# EAGLE design switching_unit (EAGLE 7.2.0)
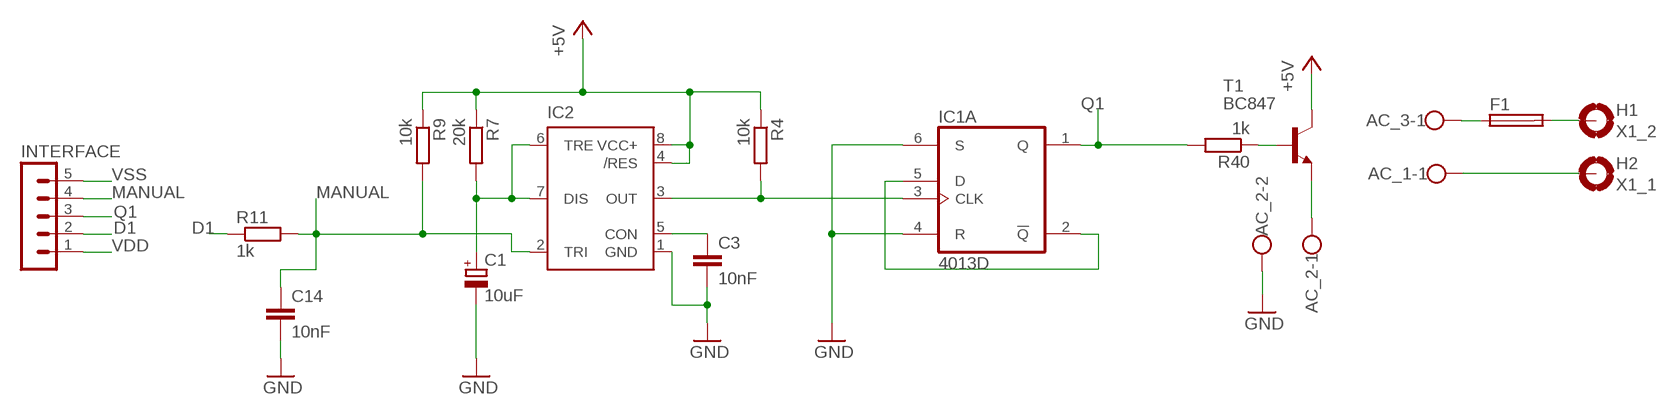
[diagram p0: schematic, sheet 1]

## Parts
AC_1  W237-102  [W237-102]
AC_2  W237-102  [W237-102]
AC_3  W237-102  [W237-102]
C1  10uF  CPOL-EU153CLV-0405  [153CLV-0405]
C3  10nF  C-EUC1206  [C1206]
C14  10nF  C-EUC1206  [C1206]
F1  SH22,5A  [SH22,5A]
H1  X1_2  MOUNT-PAD-ROUND2.8  [2,8-PAD]
H2  X1_1  MOUNT-PAD-ROUND2.8  [2,8-PAD]
IC1  4013D  [SO14]
IC2  NE555D  [SO08]
INTERFACE  MA05-1  [MA05-1]
R4  10k  R-EU_R1206  [R1206]
R7  20k  R-EU_R1206  [R1206]
R9  10k  R-EU_R1206  [R1206]
R11  1k  R-EU_R1206  [R1206]
R40  1k  R-EU_R1206  [R1206]
T1  BC847  [SOT23]

## Nets
D1: INTERFACE.2 R11.1
MANUAL: C14.1 IC2.2(TRI) INTERFACE.4 R9.2 R11.2
N$1: R40.1 T1.1(B)
N$2: F1.2 H1.B2,8(MOUNT)
N$3: AC_1.1 H2.B2,8(MOUNT)
N$4: AC_2.1 T1.2(E)
N$8: IC1.2(A:!Q) IC1.5(A:D)
N$14: IC1.3(A:CLK) IC2.3(OUT) R4.2
N$15: C1.+ IC2.6(TRE) IC2.7(DIS) R7.2
N$18: C3.1 IC2.5(CON)
N$52: AC_3.1 F1.1
Q1: IC1.1(A:Q) INTERFACE.3 R40.2
VDD: IC2.4(/RES) IC2.8(VCC+) INTERFACE.1 R4.1 R7.1 R9.1 T1.3(C) ; supply symbol labelled +5V
VSS: AC_2.2 C1.- C3.2 C14.2 IC1.4(A:R) IC1.6(A:S) IC2.1(GND) INTERFACE.5 ; supply symbol labelled GND
Unconnected: AC_1.2 AC_3.2 IC1.8(B:S) IC1.9(B:D) IC1.10(B:R) IC1.11(B:CLK) IC1.12(B:!Q) IC1.13(B:Q)

## Power pins joined to a net without a drawn wire
VDD: IC1.14(P:VDD)
VSS: IC1.7(P:VSS)

## Library data of the parts
AC_1-AC_3 = con-wago-500:W237-102: WAGO SCREW CLAMP; MPN: 237-102; OC_FARNELL: unknown; OC_NEWARK: 70K9898
C1 = resistor:CPOL-EU: POLARIZED CAPACITOR, European symbol
C3 C14 = rcl:C-EU: CAPACITOR, European symbol
F1 = fuse (2):SH22,5A: FUSE HOLDER grid 22,5mm, isolated cap OGN0031 8201, Schurter (Buerklin)
H1 H2 = holes:MOUNT-PAD-ROUND: MOUNTING PAD, round
IC1 = 40xx:4013: Dual D FLIP FLOP, set/reset
IC2 = SparkFun-AnalogIC:NE555: General purpose bipolar Timer
INTERFACE = con-lstb:MA05-1: PIN HEADER; OC_FARNELL: unknown; OC_NEWARK: unknown
R4 R7 R9 R11 R40 = rcl:R-EU_: RESISTOR, European symbol
T1 = transistor-neu-to92:BC847: NPN TRANSISTOR

## Board
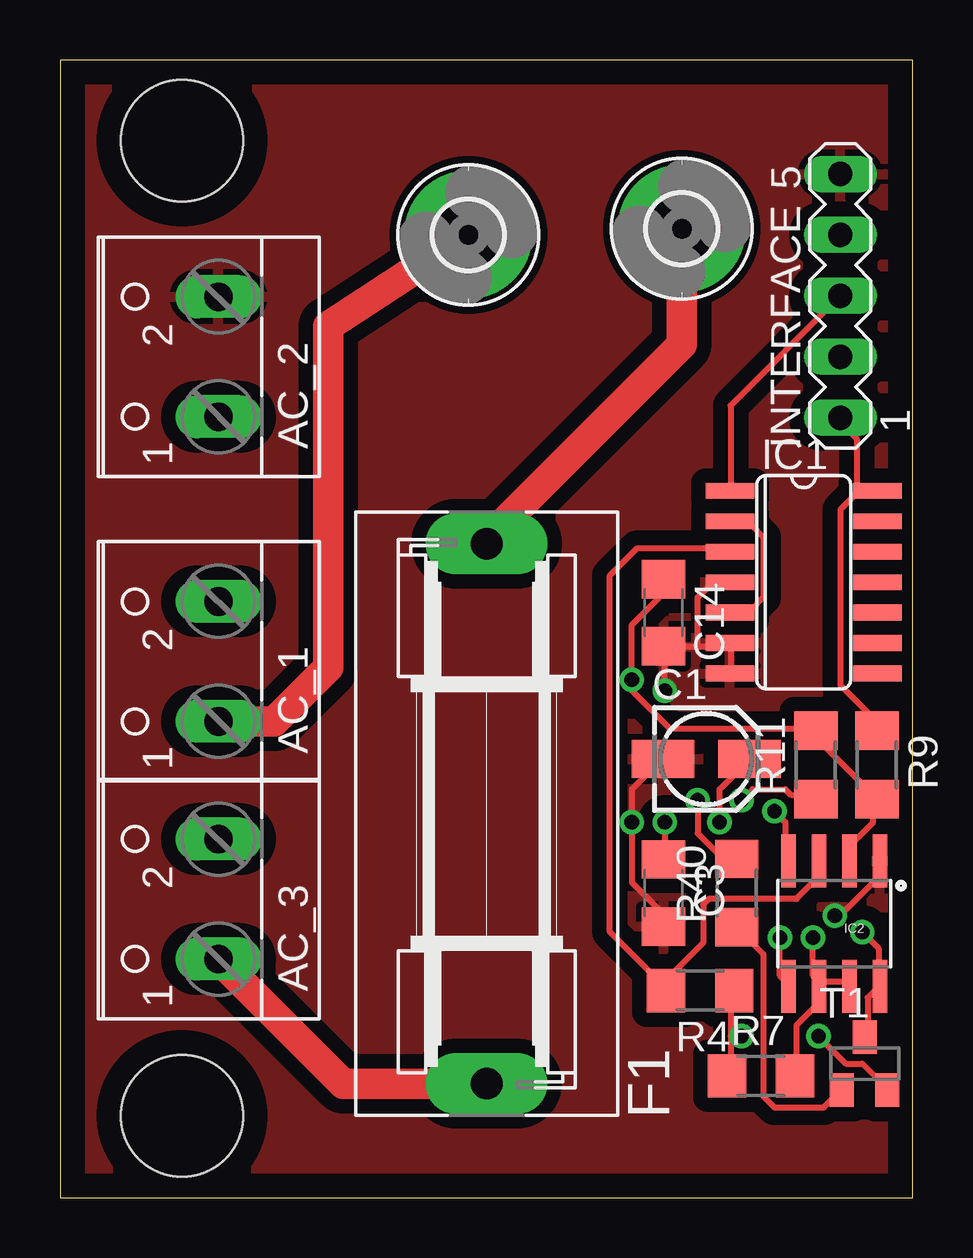
[diagram p1: board, top side]
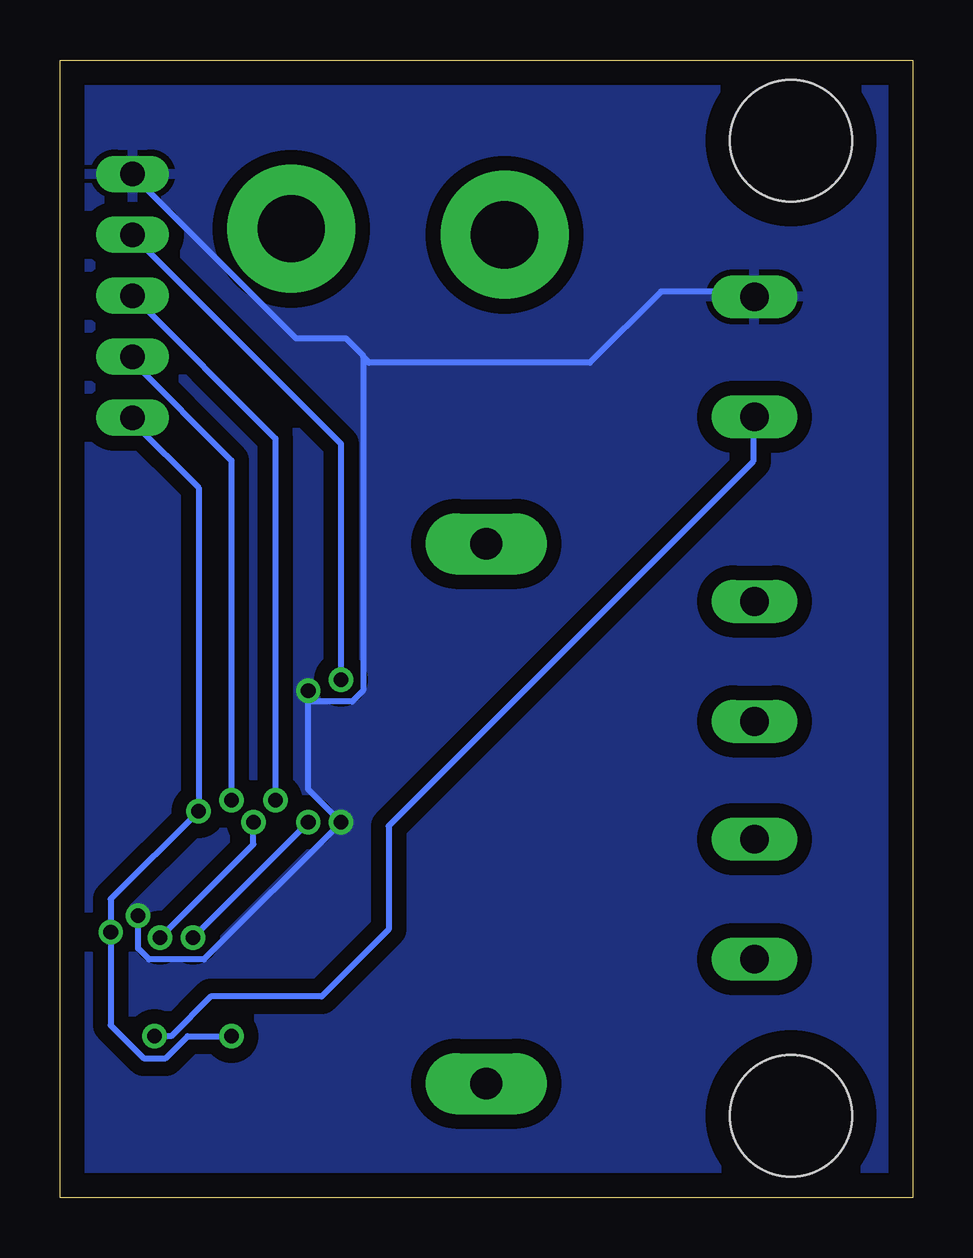
[diagram p2: board, bottom side, seen from below]

Size 35.54 x 47.42 mm. Coordinates in mm from the lower left corner, seen from the top.
Outline: 0,0 35.54,0 35.54,47.42 0,47.42 0,0
Copper layers (1*16): Top 0.035mm / dielectric 1.5mm / Bottom 0.035mm
Design rules "default": minimum track width 10mil, minimum drill 24mil, track to track 8mil, track to pad 8mil, pad to pad 8mil, via to via 8mil, smd to smd 8mil, copper to edge 40mil, drill to drill 8mil, minimum pad ring 10mil, minimum via ring 8mil, stop-mask expansion 4mil, vias tented up to drill 0mil, thermal gap 10mil
Holes 5.08 mm at 5.09,44.05 5.09,3.41

### Footprints (pad centres in the part's own frame; a part is rotated, then mirrored left to right if it is on the bottom)
W237-102 = drill 1.194 long: 1 -2.5,-1.27; 2 2.5,-1.27
153CLV-0405 = smd 2.6 x 1.6: + 1.8,0; - -1.8,0
C1206 = smd 1.6 x 1.8: 1 -1.4,0; 2 1.4,0
SH22,5A = drill 1.321 pad 2.54 long: 1 -11.252,0; 2 11.252,0
2,8-PAD = drill 2.8 pad 5.334: B2,8 0,0
SO14 = smd 0.66 x 2.032: 1 -3.81,-3.073; 2 -2.54,-3.073; 3 -1.27,-3.073; 4 0,-3.073; 5 1.27,-3.073; 6 2.54,-3.073; 7 3.81,-3.073; 8 3.81,3.073; 9 2.54,3.073; 10 1.27,3.073; 11 0,3.073; 12 -1.27,3.073; 13 -2.54,3.073; 14 -3.81,3.073
SO08 = smd 0.61 x 2.21: 1 -1.905,-2.616; 2 -0.635,-2.616; 3 0.635,-2.616; 4 1.905,-2.616; 5 1.905,2.616; 6 0.635,2.616; 7 -0.635,2.616; 8 -1.905,2.616
MA05-1 = drill 1.016 long: 1 -5.08,0; 2 -2.54,0; 3 0,0; 4 2.54,0; 5 5.08,0
R1206 = smd 1.6 x 1.803: 1 -1.422,0; 2 1.422,0
SOT23 = smd 1 x 1.4: 1 -0.95,-1.1; 2 0.95,-1.1; 3 0,1.1

### Placement (x,y rotation side)
AC_1  5.33,22.35 90 top
AC_2  5.33,35.05 90 top
AC_3  5.33,12.45 90 top
C1  26.92,18.29 0 top
C3  25.15,12.7 270 top
C14  25.15,24.38 270 top
F1  17.78,16 90 top
H1  25.91,40.39 0 top
H2  17.02,40.13 0 top
IC1  30.99,25.65 270 top
IC2  32.26,11.43 180 top
INTERFACE  32.51,37.59 90 top
R4  26.67,8.64 180 top
R7  29.21,5.08 0 top
R9  34.04,18.03 270 top
R11  31.5,18.03 90 top
R40  28.19,12.7 90 top
T1  33.53,5.59 0 top

### Tracks (layer width: path | path; a pad name or v marks a point on that pad's centre or on a via)
D1  (via drill 0.61)
  Top 0.254: v28.4,16.56 28.85,17.02 30.23,17.02 30.45,16.79 31.37,16.79 R11.1
  Bottom 0.254: v28.4,16.56 28.4,30.73 32.51,34.85 INTERFACE.2
MANUAL  (via drill 0.61)
  Top 0.254: IC2.2 32.97,14.05 32.97,14.73 33.88,15.65 33.88,16.56 R9.2 33.88,16.79 31.37,19.3 R11.2 31.37,19.53 25.42,19.53 23.82,21.13 v23.82,21.59 23.82,23.88 24.97,25.02 24.97,25.71 C14.1
  Bottom 0.254: v23.82,21.59 23.82,31.42 32.51,40.11 INTERFACE.4
N$1
  Top 0.254: T1.1 32.51,4.45 31.83,3.76 29.77,3.76 29.31,4.22 29.31,10.16 28.4,11.07 R40.1
N$2
  Top 1.27: F1.2 17.78,27.43 25.91,35.56 H1.B2,8
N$3
  Top 1.27: AC_1.1 8.93,19.85 11.18,22.1 11.18,36.32 H2.B2,8
N$4  (via drill 0.61)
  Top 0.254: v31.6,6.73 32.74,5.59 33.43,5.59 34.34,4.67 T1.2
  Bottom 0.254: v31.6,6.73 30.91,6.73 29.26,8.38 24.64,8.38 21.84,11.18 21.84,15.49 6.65,30.68 6.65,32.51 AC_2.1
N$8
  Top 0.254: IC1.5 27.94,24.56 28.85,24.56 29.31,25.02 29.31,27.53 28.85,27.99 27.94,27.99 IC1.2
N$14
  Top 0.254: IC2.3 31.6,14.05 31.6,13.36 30.68,12.45 27.03,12.45 26.8,12.22 26.8,10.62 25.42,9.25 25.42,8.79 R4.2 25.2,8.79 22.91,11.07 22.91,25.93 24.05,27.08 27.71,27.08 IC1.3
N$15  (via drill 0.61)
  Top 0.254: R7.2 30.68,5.13 30.68,7.19 31.6,8.1 31.6,8.79 IC2.6 | IC2.7 32.74,9.02 31.83,9.02 IC2.6 | v27.48,15.65 27.48,17.02 28.63,18.16 C1.+ | v31.37,10.85 31.37,9.25 31.6,9.02 IC2.6
  Bottom 0.254: v27.48,15.65 27.48,14.73 v31.37,10.85
N$18  (via drill 0.61)
  Top 0.254: v25.2,15.65 25.2,14.28 C3.1 | v30,10.85 30,9.25 30.23,9.02 IC2.5
  Bottom 0.254: v30,10.85 v25.2,15.65
N$52
  Top 1.27: F1.1 11.8,4.75 AC_3.1
Q1  (via drill 0.61)
  Top 0.254: v26.57,16.56 26.57,15.19 27.48,14.28 28.17,14.28 R40.2 | INTERFACE.3 27.94,33.02 27.94,29.59 IC1.1
  Bottom 0.254: v26.57,16.56 26.57,31.65 INTERFACE.3
VDD  (via drill 0.61)
  Top 0.254: 33.2,29.36 32.51,28.68 32.51,21.36 33.88,19.99 33.88,19.53 R9.1 | 33.2,29.36 33.88,29.36 IC1.14 33.2,29.36 | 27.94,6.73 27.94,8.56 R4.1 | 27.94,6.73 27.94,5.13 R7.1 | T1.3 33.66,6.73 33.66,8.33 34.11,8.79 IC2.8 34.11,9.02 34.11,10.39 v33.43,11.07 | v29.77,16.1 30.23,15.65 30.23,14.05 IC2.4 | v28.4,6.73 27.94,6.73 | 33.2,29.36 33.2,31.65 32.51,32.33 INTERFACE.1
  Bottom 0.254: INTERFACE.1 32.51,32.33 29.77,29.59 v29.77,16.1 33.43,12.45 v33.43,11.07 33.43,7.19 32.05,5.82 31.14,5.82 30.23,6.73 v28.4,6.73
VSS  (via drill 0.61)
  Top 0.254: 26.57,22.96 27.71,22.96 IC1.6 27.94,22.96 27.94,22.05 IC1.7 | 26.57,22.96 25.2,22.96 | 26.57,22.96 26.57,25.02 27.03,25.48 27.71,25.48 IC1.4 | C3.2 24.97,11.3 24.97,11.99 23.82,13.13 v23.82,15.65 23.82,17.02 24.97,18.16 C1.- | v32.28,11.76 32.51,11.76 34.11,13.36 34.11,14.05 IC2.1 | v25.2,21.13 25.2,22.96 | 25.2,22.96 C14.2
  Bottom 0.254: v32.28,11.76 32.28,10.39 31.83,9.93 29.54,9.93 v23.82,15.65 25.2,17.02 25.2,20.68 | INTERFACE.5 32.51,42.62 25.7,35.81 23.62,35.81 22.91,35.1 22.91,35.05 | AC_2.2 6.65,37.77 10.49,37.77 13.46,34.8 22.66,34.8 22.91,35.05 | 25.2,20.68 23.37,20.68 22.91,21.13 22.91,35.05 | 25.2,20.68 v25.2,21.13
  pour Top (isolate 0.61): 0,47.24 0,0 35.56,0 35.56,47.24
  pour Bottom (isolate 0.61): 0,47.24 0,0 35.56,0 35.56,47.24

### Text on the board
tDocu: A_N | A_L